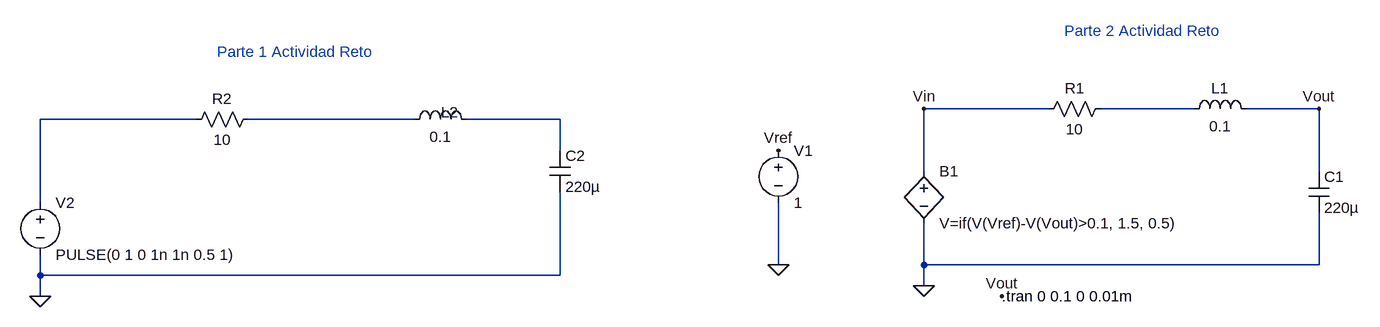
[diagram p0: schematic ActividadRetoMendez.asc]
ActividadRetoMendez.asc, the LTspice schematic file:
Version 4
SHEET 1 1864 680
WIRE 880 -16 688 -16
WIRE 1104 -16 960 -16
WIRE 1296 -16 1184 -16
WIRE -432 0 -672 0
WIRE -96 0 -352 0
WIRE 128 0 -16 0
WIRE 128 48 128 0
WIRE 688 80 688 -16
WIRE 1296 80 1296 -16
WIRE -672 128 -672 0
WIRE 464 224 464 128
WIRE 688 224 688 160
WIRE 1296 224 1296 144
WIRE 1296 224 688 224
WIRE -672 240 -672 208
WIRE 128 240 128 112
WIRE 128 240 -672 240
WIRE 688 256 688 224
WIRE -672 272 -672 240
FLAG 688 256 0
FLAG 1296 -16 Vout
FLAG 808 272 Vout
FLAG 464 48 Vref
FLAG 688 -16 Vin
FLAG 464 224 0
FLAG -672 272 0
SYMBOL res 976 -32 R90
WINDOW 0 0 56 VBottom 2
WINDOW 3 32 56 VTop 2
SYMATTR InstName R1
SYMATTR Value 10
SYMBOL ind 1088 0 R270
WINDOW 0 32 56 VTop 2
WINDOW 3 5 56 VBottom 2
SYMATTR InstName L1
SYMATTR Value 0.1
SYMBOL cap 1280 80 R0
SYMATTR InstName C1
SYMATTR Value 220µ
SYMBOL voltage 464 32 R0
WINDOW 123 0 0 Left 2
WINDOW 39 0 0 Left 2
SYMATTR InstName V1
SYMATTR Value 1
SYMBOL bv 688 64 R0
SYMATTR InstName B1
SYMATTR Value V=if(V(Vref)-V(Vout)>0.1, 1.5, 0.5)
SYMBOL ind -112 16 R270
WINDOW 0 11 70 VTop 2
WINDOW 3 5 56 VBottom 2
SYMATTR InstName L2
SYMATTR Value 0.1
SYMBOL cap 112 48 R0
SYMATTR InstName C2
SYMATTR Value 220µ
SYMBOL res -336 -16 R90
WINDOW 0 0 56 VBottom 2
WINDOW 3 32 56 VTop 2
SYMATTR InstName R2
SYMATTR Value 10
SYMBOL voltage -672 112 R0
WINDOW 123 0 0 Left 2
WINDOW 39 0 0 Left 2
SYMATTR InstName V2
SYMATTR Value PULSE(0 1 0 1n 1n 0.5 1)
TEXT 808 272 Left 2 !.tran 0 0.1 0 0.01m
TEXT 904 -136 Left 2 ;Parte 2 Actividad Reto
TEXT -400 -104 Left 2 ;Parte 1 Actividad Reto

The netlist it stands for:
* ActividadRetoMendez.asc
R1 N001 Vin 10
L1 N001 Vout 0.1
C1 Vout 0 220µ
V1 Vref 0 1
B1 Vin 0 V=if(V(Vref)-V(Vout)>0.1, 1.5, 0.5)
L2 N003 N004 0.1
C2 N004 0 220µ
R2 N003 N002 10
V2 N002 0 PULSE(0 1 0 1n 1n 0.5 1)
.tran 0 0.1 0 0.01m
* Parte 2 Actividad Reto
* Parte 1 Actividad Reto
.backanno
.end